# EAGLE schematic MPPT (EAGLE 7.5.0)
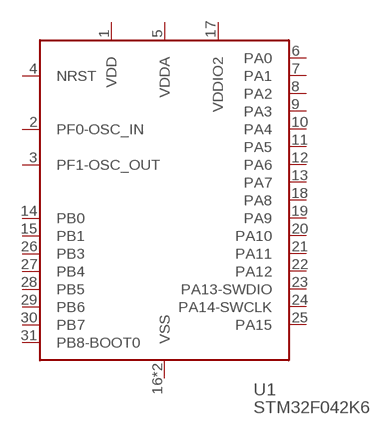
[diagram p0: schematic, sheet 1]

## Parts
U1  STM32F042K6  [QFP32-7X7]
Unconnected: U1.2(PF0-OSC_IN) U1.3(PF1-OSC_OUT) U1.4(NRST) U1.6(PA0) U1.7(PA1) U1.8(PA2) U1.9(PA3) U1.10(PA4) U1.11(PA5) U1.12(PA6) U1.13(PA7) U1.14(PB0) U1.15(PB1) U1.18(PA8) U1.19(PA9) U1.20(PA10) U1.21(PA11) U1.22(PA12) U1.23(PA13-SWDIO) U1.24(PA14-SWCLK) U1.25(PA15) U1.26(PB3) U1.27(PB4) U1.28(PB5) U1.29(PB6) U1.30(PB7) U1.31(PB8-BOOT0)

## Power pins joined to a net without a drawn wire
VDD: U1.1(VDD)
VDDA: U1.5(VDDA)
VDDIO2: U1.17(VDDIO2)
VSS: U1.16(VSS) U1.32(VSS)

## Library data of the parts
U1 = STM32F042K:STM32F042K6